# Altium project PCB_Project1.PrjPCB
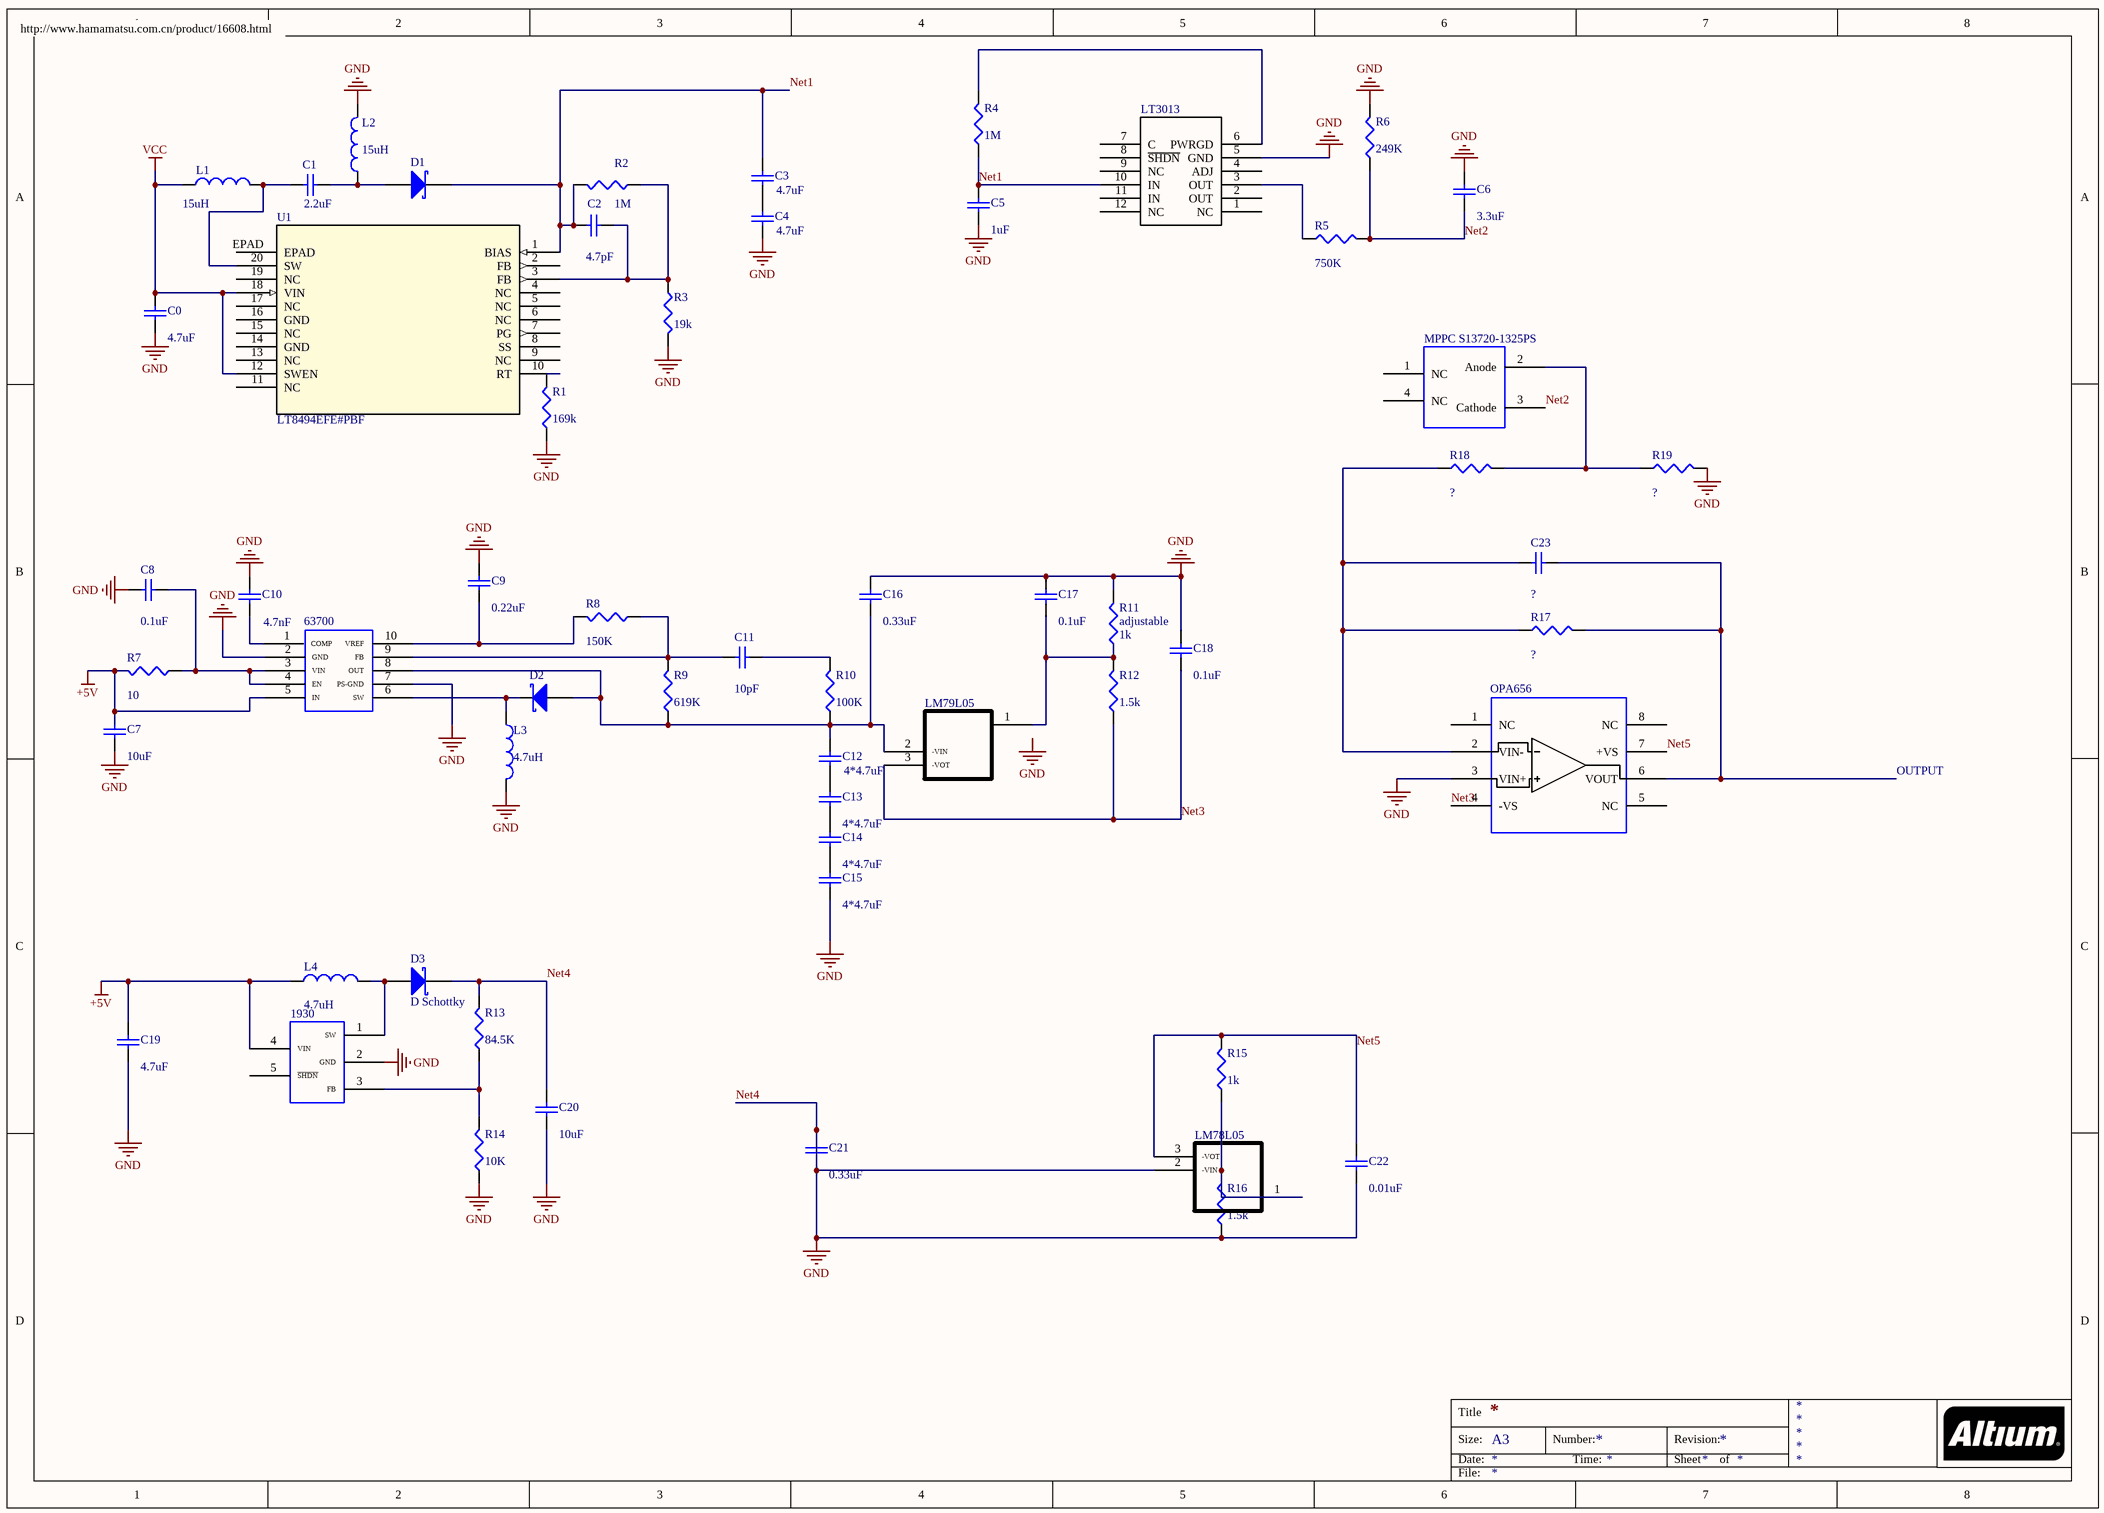
[diagram p0: YUANLITU (1).~(20).~(1).SchDoc]
1 sheet, 58 parts. Net scope: global (net labels, ports and power ports of the same name join across sheets).
Board file: PCB1.PcbDoc

## Sheet YUANLITU (1).~(20).~(1).SchDoc
size A3

### Parts
1930  (no value)  [SOT-23_S5]
63700  (no value)  [DRC10_2P4X1P65]
C0  value 4.7uF  [0603]
C1  value 2.2uF  [0603]
C2  value 4.7pF  [0603]
C3  value 4.7uF  [C1210]
C4  value 4.7uF  [C1210]
C5  value 1uF  [C1210]
C6  value 3.3uF  [C1210]
C7  value 10uF  [0603]
C8  value 0.1uF  [0603]
C9  value 0.22uF  [0603]
C10  value 4.7nF  [0603]
C11  value 10pF  [0603]
C12  value 4*4.7uF  [0603]
C13  value 4*4.7uF  [0603]
C14  value 4*4.7uF  [0603]
C15  value 4*4.7uF  [0603]
C16  value 0.33uF  [0603]
C17  value 0.1uF  [0603]
C18  value 0.1uF  [0603]
C19  value 4.7uF  [0603]
C20  value 10uF  [0603]
C21  value 0.33uF  [0603]
C22  value 0.01uF  [0603]
C23  (no value)  [0603]
D1  (no value)  [SMB]
D2  (no value)  [SMB]
D3  D Schottky  [SMB]
L1  value 15uH  [0603]
L2  value 15uH  [0603]
L3  value 4.7uH  [0603]
L4  value 4.7uH  [0603]
LM78L05  (no value)  [PCBComponent_1]
LM79L05  (no value)  [PCBComponent_1]
LT3013  (no value)  [DFN-12_DE]
MPPC_S13720-1325PS  (no value)  [PCBComponent_1]
OPA656  (no value)  [D8]
R1  value 169k  [0603]
R2  value 1M  [0603]
R3  value 19k  [0603]
R4  value 1M  [0603]
R5  value 750K  [0603]
R6  value 249K  [0603]
R7  value 10  [0603]
R8  value 150K  [0603]
R9  value 619K  [0603]
R10  value 100K  [0603]
R11  adjustable  value 1k  [0603]
R12  value 1.5k  [0603]
R13  value 84.5K  [0603]
R14  value 10K  [J1-0603]
R15  value 1k  [J1-0603]
R16  value 1.5k  [J1-0603]
R17  (no value)  [J1-0603]
R18  (no value)  [J1-0603]
R19  (no value)  [J1-0603]
U1  LT8494EFE#PBF  [TSSOP-20_FE/CB]

### Nets
+5V: 1930.4(VIN) 63700.5(IN) C7.2 C19.2 L4.1 R7.2
Net4: 1930.2(GND) 63700.2(GND) 63700.7(PS-GND) C0.1 C4.2 C5.1 C6.2 C7.1 C8.1 C9.2 C10.2 C15.1 C16.1 C17.1 C18.2 C19.1 C20.1 C20.2 C21.1 C21.2 C22.1 D3.2(K) L2.2 L3.2 LM78L05.2(-VIN) LT3013.5(GND) OPA656.3(VIN+) R1.1 R3.2 R6.2 R11.2 R13.2 R14.1 R16.1 R19.2  [also labelled GND]
VCC: C0.2 L1.1 U1.12(SWEN) U1.18(VIN)
Net1: C2.2 C3.1 C5.2 D1.2(K) LT3013.10(IN) R2.2 R4.1 U1.1(BIAS)
Net2: C6.1 MPPC_S13720-1325PS.3(Cathode) R5.2 R6.1
Net3: C18.1 LM79L05.3(-VOT) OPA656.4(-VS) R12.1
Net5: C22.2 LM78L05.3(-VOT) OPA656.7(+VS) R15.2
Net1930_1: 1930.1(SW) D3.1(A) L4.2
Net1930_3: 1930.3(FB) R13.1 R14.2
Net63700_1: 63700.1(COMP) C10.1
Net63700_3: 63700.3(VIN) 63700.4(EN) C8.2 R7.1
Net63700_6: 63700.6(SW) D2.2(K) L3.1
Net63700_8: 63700.8(OUT) C12.2 C16.2 D2.1(A) LM79L05.2(-VIN) R9.1 R10.1
Net63700_9: 63700.9(FB) C11.1 R8.1 R9.2
Net63700_10: 63700.10(VREF) C9.1 R8.2
NetC1_1: C1.1 D1.1(A) L2.1
NetC1_2: C1.2 L1.2 U1.20(SW)
NetC2_1: C2.1 R2.1 R3.1 U1.3(FB)
NetC3_2: C3.2 C4.1
NetC11_2: C11.2 R10.2
NetC12_1: C12.1 C13.2
NetC13_1: C13.1 C14.2
NetC14_1: C14.1 C15.2
NetC17_2: C17.2 LM79L05.1 R11.1 R12.2
NetC23_1: C23.1 OPA656.2(VIN-) R17.1 R18.1
NetC23_2: C23.2 OPA656.6(VOUT) R17.2
NetLM78L05_1: LM78L05.1 R15.1 R16.2
NetLT3013_3: LT3013.3(OUT) R5.1
NetLT3013_6: LT3013.6(PWRGD) R4.2
NetMPPC_S13720-1325PS_2: MPPC_S13720-1325PS.2(Anode) R18.2 R19.1
NetR1_2: R1.2 U1.10(RT)

Not connected (* = marked no-connect by the designer): 1930 5(~{SHDN}); LT3013 1(NC) 2(OUT) 4(ADJ) 7(C) 8(~{SHDN}) 9(NC) 11(IN) 12(NC); MPPC_S13720-1325PS 1(NC) 4(NC); OPA656 1(NC) 5(NC) 8(NC); U1 2(FB) 4(NC) 5(NC) 6(NC) 7(PG) 8(SS) 9(NC) 11(NC) 13(NC) 14(GND) 15(NC) 16(GND) 17(NC) 19(NC) EPAD

### Notes on the sheet
- http://www.hamamatsu.com.cn/product/16608.html
- OUTPUT
- Labels drawn without touching a wire or pin: GND
- Title
- Size:
- Date:
- A3
- Number:
- Time:
- Revision:
- Sheet
- of
- File:

### Library data of the parts
1930 = 1930
63700 = 63700
C0-C23 = Cap: Capacitor; Published: 8-Jun-2000; LatestRevisionDate: 17-Jul-2002; LatestRevisionNote: Re-released for DXP Platform.; PackageReference: RAD-0.3; Publisher: Altium Limited; PackageDescription: Radial Cap, Thru-Hole; 2 Leads; 0.3 in Pin Spacing
  C23: Value: ?
D1-D3 = D Schottky: Schottky Diode; Published: 8-Jun-2000; LatestRevisionDate: 17-Jul-2002; LatestRevisionNote: Re-released for DXP Platform.; PackageReference: SMB; Publisher: Altium Limited; PackageDescription: DO-214-AA/SMB; 2 C-Bend Leads; Body 5.3 x 3.6 mm, inc. leads (LxW); Code_JEDEC: DO-214-AA
L1-L4 = Inductor: Code_IEC: 1005; Published: 8-Jun-2000; LatestRevisionDate: 29-May-2009; LatestRevisionNote: IPC-7351 Footprint Added.; PackageReference: 0402-A; Publisher: Altium Limited; PackageDescription: Chip Inductor; Code_JEITA: 0402
LM78L05 LM79L05 = LM79L05
LT3013 = 3013
MPPC_S13720-1325PS = MPPC S13720-1325PS
OPA656 = OPA656
R1-R19 = Res3: Resistor; Published: 8-Jun-2000; LatestRevisionDate: 29-May-2009; LatestRevisionNote: IPC-7351 Footprint Added.; PackageReference: J1-0603; Publisher: Altium Limited; PackageDescription: Chip Resistor
  R17-R19: Value: ?
U1 = LT8494EFE#PBF: Imported; Vendor: Linear Technology; Manufacturer_Part_Number: lt8494efe#pbf; Value: Value; Type: Type; RefDes: RefDes